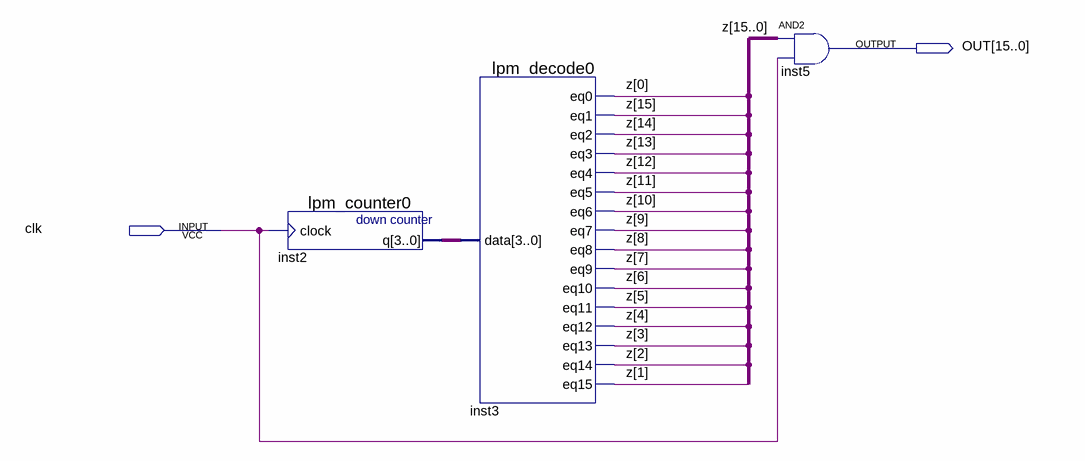
[diagram p0: schematic sheet]
// Quartus schematic block3t.bdf as structural Verilog: 3 symbols, 2 pins
module block3t (
  input  clk,
  output [15:0] OUT
);

  wire [3:0] inst2_q;
  wire [15:0] z;

  lpm_counter0 inst2 (.clock(clk), .q(inst2_q));
  lpm_decode0 inst3 (
    .data(inst2_q), .eq0(z[0]), .eq1(z[15]), .eq2(z[14]), .eq3(z[13]), .eq4(z[12]), .eq5(z[11]), .eq6(z[10]),
    .eq7(z[9]), .eq8(z[8]), .eq9(z[7]), .eq10(z[6]), .eq11(z[5]), .eq12(z[4]), .eq13(z[3]), .eq14(z[2]),
    .eq15(z[1]));
  assign OUT = z & {16{clk}};  // AND2 inst5, 16 bits wide
endmodule
